# Altium schematic sheet BMS Slave.SchDoc
size OrCAD C
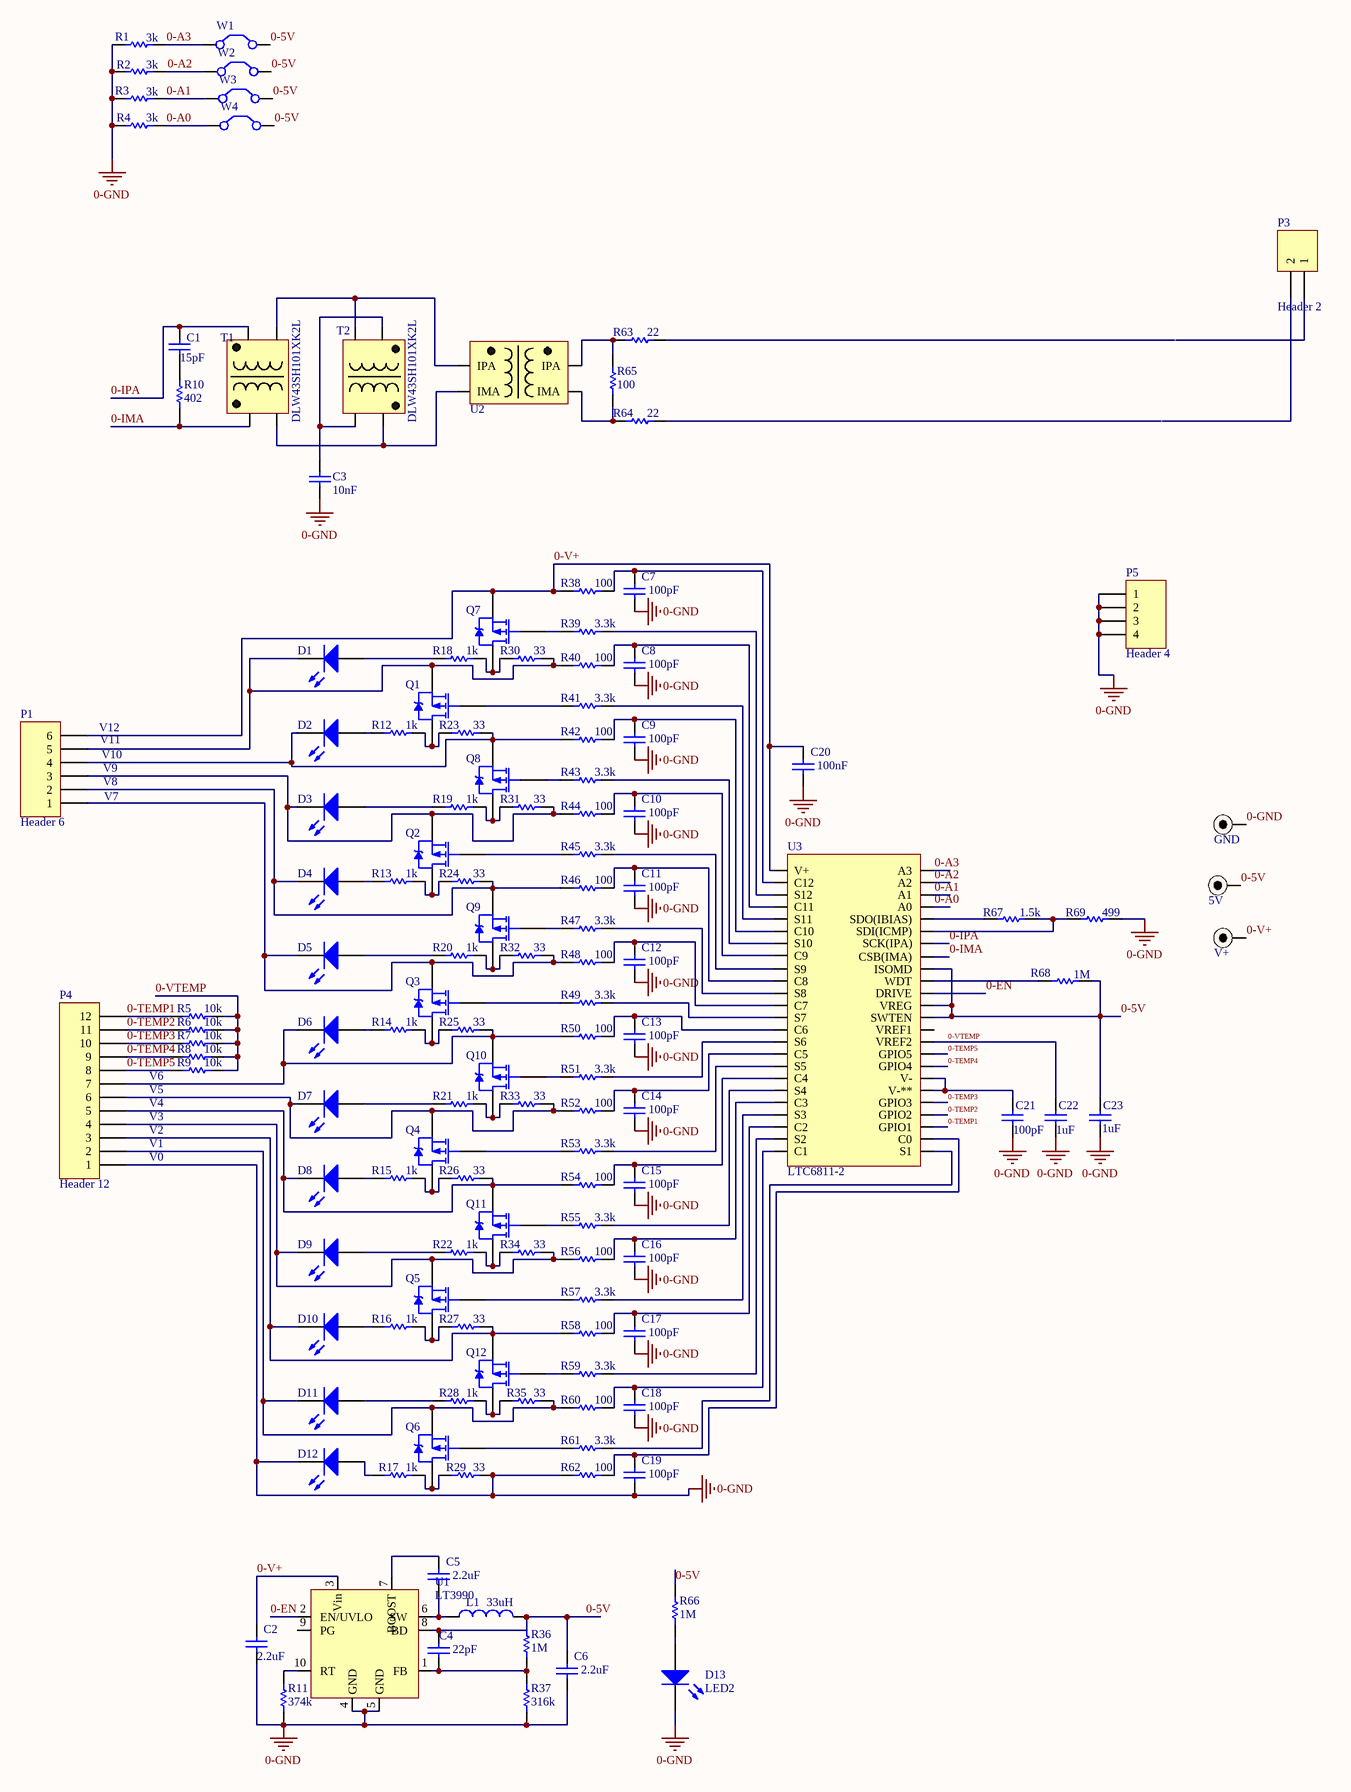
[diagram p0: BMS Slave.SchDoc]

## Parts
5V  EXPOSED SOLDER PAD  [TEST PAD]  (value not drawn)
C1  value 15pF  [6-0805_L]  (hidden comment: Cap)
C2  value 2.2uF  [6-0805_L]  (hidden comment: Cap)
C3  value 10nF  [6-0805_L]  (hidden comment: Cap)
C4  value 22pF  [6-0805_L]  (hidden comment: Cap)
C5  value 2.2uF  [6-0805_L]  (hidden comment: Cap)
C6  value 2.2uF  [6-0805_L]  (hidden comment: Cap)
C7  value 100pF  [6-0805_L]  (hidden comment: Cap)
C8  value 100pF  [6-0805_L]  (hidden comment: Cap)
C9  value 100pF  [6-0805_L]  (hidden comment: Cap)
C10  value 100pF  [6-0805_L]  (hidden comment: Cap)
C11  value 100pF  [6-0805_L]  (hidden comment: Cap)
C12  value 100pF  [6-0805_L]  (hidden comment: Cap)
C13  value 100pF  [6-0805_L]  (hidden comment: Cap)
C14  value 100pF  [6-0805_L]  (hidden comment: Cap)
C15  value 100pF  [6-0805_L]  (hidden comment: Cap)
C16  value 100pF  [6-0805_L]  (hidden comment: Cap)
C17  value 100pF  [6-0805_L]  (hidden comment: Cap)
C18  value 100pF  [6-0805_L]  (hidden comment: Cap)
C19  value 100pF  [6-0805_L]  (hidden comment: Cap)
C20  value 100nF  [6-0805_L]  (hidden comment: Cap)
C21  value 100pF  [6-0805_L]  (hidden comment: Cap)
C22  value 1uF  [6-0805_L]  (hidden comment: Cap)
C23  value 1uF  [6-0805_L]  (hidden comment: Cap)
D1  Green LED  [1608[0603]]  (value not drawn)
D2  Green LED  [1608[0603]]  (value not drawn)
D3  Green LED  [1608[0603]]  (value not drawn)
D4  Green LED  [1608[0603]]  (value not drawn)
D5  Green LED  [1608[0603]]  (value not drawn)
D6  Green LED  [1608[0603]]  (value not drawn)
D7  Green LED  [1608[0603]]  (value not drawn)
D8  Green LED  [1608[0603]]  (value not drawn)
D9  Green LED  [1608[0603]]  (value not drawn)
D10  Green LED  [1608[0603]]  (value not drawn)
D11  Green LED  [1608[0603]]  (value not drawn)
D12  Green LED  [1608[0603]]  (value not drawn)
D13  LED2  [3.2X1.6X1.1]
GND  EXPOSED SOLDER PAD  [TEST PAD]  (value not drawn)
L1  value 33uH  [0402-A]  (hidden comment: Inductor)
P1  Header 6  [HDR2X3_CEN]
P3  Header 2  [MOLEX MICROCLASP 2POS RIGHT ANGLE]
P4  Header 12  [HDR2X6]
P5  Header 4  [HDR2X2]
Q1  SI2347DS-T1-GE3  [SOT23-3N]  (value not drawn)
Q2  SI2347DS-T1-GE3  [SOT23-3N]  (value not drawn)
Q3  SI2347DS-T1-GE3  [SOT23-3N]  (value not drawn)
Q4  SI2347DS-T1-GE3  [SOT23-3N]  (value not drawn)
Q5  SI2347DS-T1-GE3  [SOT23-3N]  (value not drawn)
Q6  SI2347DS-T1-GE3  [SOT23-3N]  (value not drawn)
Q7  SI2347DS-T1-GE3  [SOT23-3N]  (value not drawn)
Q8  SI2347DS-T1-GE3  [SOT23-3N]  (value not drawn)
Q9  SI2347DS-T1-GE3  [SOT23-3N]  (value not drawn)
Q10  SI2347DS-T1-GE3  [SOT23-3N]  (value not drawn)
Q11  SI2347DS-T1-GE3  [SOT23-3N]  (value not drawn)
Q12  SI2347DS-T1-GE3  [SOT23-3N]  (value not drawn)
R1  value 3k  [6-0805_L]  (hidden comment: Res1)
R2  value 3k  [6-0805_L]  (hidden comment: Res1)
R3  value 3k  [6-0805_L]  (hidden comment: Res1)
R4  value 3k  [6-0805_L]  (hidden comment: Res1)
R5  value 10k  [6-0805_L]  (hidden comment: Res1)
R6  value 10k  [6-0805_L]  (hidden comment: Res1)
R7  value 10k  [6-0805_L]  (hidden comment: Res1)
R8  value 10k  [6-0805_L]  (hidden comment: Res1)
R9  value 10k  [6-0805_L]  (hidden comment: Res1)
R10  value 402  [6-0805_L]  (hidden comment: Res1)
R11  value 374k  [6-0805_L]  (hidden comment: Res1)
R12  value 1k  [1608[0603]]  (hidden comment: ESR03EZPJ102)
R13  value 1k  [1608[0603]]  (hidden comment: ESR03EZPJ102)
R14  value 1k  [1608[0603]]  (hidden comment: ESR03EZPJ102)
R15  value 1k  [1608[0603]]  (hidden comment: ESR03EZPJ102)
R16  value 1k  [1608[0603]]  (hidden comment: ESR03EZPJ102)
R17  value 1k  [1608[0603]]  (hidden comment: ESR03EZPJ102)
R18  value 1k  [1608[0603]]  (hidden comment: ESR03EZPJ102)
R19  value 1k  [1608[0603]]  (hidden comment: ESR03EZPJ102)
R20  value 1k  [1608[0603]]  (hidden comment: ESR03EZPJ102)
R21  value 1k  [1608[0603]]  (hidden comment: ESR03EZPJ102)
R22  value 1k  [1608[0603]]  (hidden comment: ESR03EZPJ102)
R23  value 33  [RES_4122]  (hidden comment: Res1)
R24  value 33  [RES_4122]  (hidden comment: Res1)
R25  value 33  [RES_4122]  (hidden comment: Res1)
R26  value 33  [RES_4122]  (hidden comment: Res1)
R27  value 33  [RES_4122]  (hidden comment: Res1)
R28  value 1k  [1608[0603]]  (hidden comment: ESR03EZPJ102)
R29  value 33  [RES_4122]  (hidden comment: Res1)
R30  value 33  [RES_4122]  (hidden comment: Res1)
R31  value 33  [RES_4122]  (hidden comment: Res1)
R32  value 33  [RES_4122]  (hidden comment: Res1)
R33  value 33  [RES_4122]  (hidden comment: Res1)
R34  value 33  [RES_4122]  (hidden comment: Res1)
R35  value 33  [RES_4122]  (hidden comment: Res1)
R36  value 1M  [6-0805_L]  (hidden comment: Res1)
R37  value 316k  [6-0805_L]  (hidden comment: Res1)
R38  value 100  [6-0805_L]  (hidden comment: Res1)
R39  value 3.3k  [6-0805_L]  (hidden comment: Res1)
R40  value 100  [6-0805_L]  (hidden comment: Res1)
R41  value 3.3k  [6-0805_L]  (hidden comment: Res1)
R42  value 100  [6-0805_L]  (hidden comment: Res1)
R43  value 3.3k  [6-0805_L]  (hidden comment: Res1)
R44  value 100  [6-0805_L]  (hidden comment: Res1)
R45  value 3.3k  [6-0805_L]  (hidden comment: Res1)
R46  value 100  [6-0805_L]  (hidden comment: Res1)
R47  value 3.3k  [6-0805_L]  (hidden comment: Res1)
R48  value 100  [6-0805_L]  (hidden comment: Res1)
R49  value 3.3k  [6-0805_L]  (hidden comment: Res1)
R50  value 100  [6-0805_L]  (hidden comment: Res1)
R51  value 3.3k  [6-0805_L]  (hidden comment: Res1)
R52  value 100  [6-0805_L]  (hidden comment: Res1)
R53  value 3.3k  [6-0805_L]  (hidden comment: Res1)
R54  value 100  [6-0805_L]  (hidden comment: Res1)
R55  value 3.3k  [6-0805_L]  (hidden comment: Res1)
R56  value 100  [6-0805_L]  (hidden comment: Res1)
R57  value 3.3k  [6-0805_L]  (hidden comment: Res1)
R58  value 100  [6-0805_L]  (hidden comment: Res1)
R59  value 3.3k  [6-0805_L]  (hidden comment: Res1)
R60  value 100  [6-0805_L]  (hidden comment: Res1)
R61  value 3.3k  [6-0805_L]  (hidden comment: Res1)
R62  value 100  [6-0805_L]  (hidden comment: Res1)
R63  value 22  [6-0805_L]  (hidden comment: Res1)
R64  value 22  [6-0805_L]  (hidden comment: Res1)
R65  value 100  [6-0805_L]  (hidden comment: Res1)
R66  value 1M  [6-0805_L]  (hidden comment: Res1)
R67  value 1.5k  [6-0805_L]  (hidden comment: Res1)
R68  value 1M  [6-0805_L]  (hidden comment: Res1)
R69  value 499  [6-0805_L]  (hidden comment: Res1)
T1  DLW43SH101XK2L  [DLW43SH101XK2L]
T2  DLW43SH101XK2L  [DLW43SH101XK2L]
U1  LT3990  [LT3990]
U2  PE68386  [PE68386]  (value not drawn)
U3  LTC6811-2  [SSOP50P780X200-48N]
V+  EXPOSED SOLDER PAD  [TEST PAD]  (value not drawn)
W1  Jumper  [jumper]  (value not drawn)
W2  Jumper  [jumper]  (value not drawn)
W3  Jumper  [jumper]  (value not drawn)
W4  Jumper  [jumper]  (value not drawn)

## Nets
0-GND: C2.1 C3.2 C6.1 C7.1 C8.1 C9.1 C10.1 C11.1 C12.1 C13.1 C14.1 C15.1 C16.1 C17.1 C18.1 C19.1 C20.1 C21.1 C22.2 C23.1 D12.2(K) D13.2(K) GND.1(PAD) P4.8(1) P5.1 P5.2 P5.3 P5.4 R1.1 R2.1 R3.1 R4.1 R11.1 R29.1 R37.1 R62.2 R69.2 U1.4(GND) U1.5(GND)
0-5V: 5V.1(PAD) C4.2 C6.2 C23.2 L1.2 R36.2 R66.1 R68.2 U1.8(BD) U3.36(SWTEN) U3.37(VREG) U3.40(ISOMD) W1.2(C2) W2.2(C2) W3.2(C2) W4.2(C2)
0-A0: R4.2 U3.45(A0) W4.1(C1)
0-A1: R3.2 U3.46(A1) W3.1(C1)
0-A2: R2.2 U3.47(A2) W2.1(C1)
0-A3: R1.2 U3.48(A3) W1.1(C1)
0-EN: U1.2(EN/UVLO) U3.38(DRIVE)
0-IMA: R10.1 T1.1 U3.41(CSB(IMA))
0-IPA: C1.2 T1.4 U3.42(SCK(IPA))
0-TEMP1: P4.10(12) R5.2 U3.27(GPIO1)
0-TEMP2: P4.12(11) R6.2 U3.28(GPIO2)
0-TEMP3: P4.11(10) R7.2 U3.29(GPIO3)
0-TEMP4: P4.9 R8.2 U3.32(GPIO4)
0-TEMP5: P4.7(8) R9.2 U3.33(GPIO5)
0-V+: C2.2 C20.2 P1.6 Q7.3(S) R38.2 U1.3(Vin) U3.1(V+) V+.1(PAD)
0-VTEMP: C22.1 R5.1 R6.1 R7.1 R8.1 R9.1 U3.34(VREF2)
NetC1_1: C1.1 R10.2
NetC3_1: C3.1 T2.1 T2.3
NetC4_1: C4.1 R36.1 R37.2 U1.1(FB)
NetC5_1: C5.1 L1.1 U1.6(SW)
NetC5_2: C5.2 U1.7(BOOST)
NetC7_2: C7.2 R38.1 U3.2(C12)
NetC8_2: C8.2 R40.1 U3.4(C11)
NetC9_2: C9.2 R42.1 U3.6(C10)
NetC10_2: C10.2 R44.1 U3.8(C9)
NetC11_2: C11.2 R46.1 U3.10(C8)
NetC12_2: C12.2 R48.1 U3.12(C7)
NetC13_2: C13.2 R50.1 U3.14(C6)
NetC14_2: C14.2 R52.1 U3.16(C5)
NetC15_2: C15.2 R54.1 U3.18(C4)
NetC16_2: C16.2 R56.1 U3.20(C3)
NetC17_2: C17.2 R58.1 U3.22(C2)
NetC18_2: C18.2 R60.1 U3.24(C1)
NetC19_2: C19.2 R62.1 U3.26(C0)
NetC21_2: C21.2 U3.30(V-**) U3.31(V-)
NetD1_1: D1.1(A) R18.1
NetD1_2: D1.2(K) P1.3(5) Q1.3(S) R30.1 R40.2
NetD2_1: D2.1(A) R12.2
NetD2_2: D2.2(K) P1.2(4) Q8.3(S) R23.1 R42.2
NetD3_1: D3.1(A) R19.1
NetD3_2: D3.2(K) P1.1(3) Q2.3(S) R31.1 R44.2
NetD4_1: D4.1(A) R13.1
NetD4_2: D4.2(K) P1.4(2) Q9.3(S) R24.1 R46.2
NetD5_1: D5.1(A) R20.1
NetD5_2: D5.2(K) P1.5(1) Q3.3(S) R32.1 R48.2
NetD6_1: D6.1(A) R14.1
NetD6_2: D6.2(K) P4.5(7) Q10.3(S) R25.1 R50.2
NetD7_1: D7.1(A) R21.1
NetD7_2: D7.2(K) P4.3(6) Q4.3(S) R33.1 R52.2
NetD8_1: D8.1(A) R15.1
NetD8_2: D8.2(K) P4.1(5) Q11.3(S) R26.1 R54.2
NetD9_1: D9.1(A) R22.1
NetD9_2: D9.2(K) P4.2(4) Q5.3(S) R34.1 R56.2
NetD10_1: D10.1(A) R16.1
NetD10_2: D10.2(K) P4.4(3) Q12.3(S) R27.1 R58.2
NetD11_1: D11.1(A) R28.1
NetD11_2: D11.2(K) P4.6(2) Q6.3(S) R35.1 R60.2
NetD12_1: D12.1(A) R17.1
NetD13_1: D13.1(A) R66.2
NetQ1_1: Q1.1(G) R41.2
NetQ1_2: Q1.2(D) R12.1 R23.2
NetQ2_1: Q2.1(G) R45.2
NetQ2_2: Q2.2(D) R13.2 R24.2
NetQ3_1: Q3.1(G) R49.2
NetQ3_2: Q3.2(D) R14.2 R25.2
NetQ4_1: Q4.1(G) R53.2
NetQ4_2: Q4.2(D) R15.2 R26.2
NetQ5_1: Q5.1(G) R57.2
NetQ5_2: Q5.2(D) R16.2 R27.2
NetQ6_1: Q6.1(G) R61.2
NetQ6_2: Q6.2(D) R17.2 R29.2
NetQ7_1: Q7.1(G) R39.2
NetQ7_2: Q7.2(D) R18.2 R30.2
NetQ8_1: Q8.1(G) R43.2
NetQ8_2: Q8.2(D) R19.2 R31.2
NetQ9_1: Q9.1(G) R47.2
NetQ9_2: Q9.2(D) R20.2 R32.2
NetQ10_1: Q10.1(G) R51.2
NetQ10_2: Q10.2(D) R21.2 R33.2
NetQ11_1: Q11.1(G) R55.2
NetQ11_2: Q11.2(D) R22.2 R34.2
NetQ12_1: Q12.1(G) R59.2
NetQ12_2: Q12.2(D) R28.2 R35.2
NetR11_2: R11.2 U1.10(RT)
NetR39_1: R39.1 U3.3(S12)
NetR41_1: R41.1 U3.5(S11)
NetR43_1: R43.1 U3.7(S10)
NetR45_1: R45.1 U3.9(S9)
NetR47_1: R47.1 U3.11(S8)
NetR49_1: R49.1 U3.13(S7)
NetR51_1: R51.1 U3.15(S6)
NetR53_1: R53.1 U3.17(S5)
NetR55_1: R55.1 U3.19(S4)
NetR57_1: R57.1 U3.21(S3)
NetR59_1: R59.1 U3.23(S2)
NetR61_1: R61.1 U3.25(S1)
NetR63_2: R63.2 R65.2 U2.4(IPA)
NetR64_2: R64.2 R65.1 U2.3(IMA)
NetR67_1: R67.1 U3.44(SDO(IBIAS))
NetR67_2: R67.2 R69.1 U3.43(SDI(ICMP))
NetR68_1: R68.1 U3.39(WDT)
NetT1_2: T1.2 T2.4 U2.2(IMA)
NetT1_3: T1.3 T2.2 U2.1(IPA)

Not connected (* = marked no-connect by the designer): P3 1 2; R63 1; R64 1; U1 9(PG); U3 35(VREF1)

## Notes on the sheet
- (near P1) V12
- (near P1) V11
- (near P1) V10
- (near P1) V9
- (near P1) V8
- (near P1) V7
- V4
- V5
- V6
- (near P4) V0
- V1
- V2
- V3
- Title
- Size:
- Date:
- File:
- Orcad C
- Number:
- Time:
- Revision:
- Sheet
- of

## Library data of the parts
5V GND V+ = EXPOSED SOLDER PAD: testing point
C1-C23 = Cap: Capacitor; Published: 8-Jun-2000; LatestRevisionDate: 17-Jul-2002; LatestRevisionNote: Re-released for DXP Platform.; PackageReference: RAD-0.3; Publisher: Altium Limited; PackageDescription: Radial Cap, Thru-Hole; 2 Leads; 0.3 in Pin Spacing
D1-D12 = LED2: LG L29K-G2J1-24-Z; Published: 8-Jun-2000; LatestRevisionDate: 17-Jul-2002; LatestRevisionNote: Re-released for DXP Platform.; PackageVersion: Feb-2002; PackageReference: 3.2X1.6X1.1; Publisher: Altium Limited; PackageDescription: SM LED; 2 Flat Leads; ComponentLink1Description: LG L29K-G2J1-24-Z; ComponentLink1URL: https://www.digikey.ca/product-detail/en/osram-opto-semiconductors-inc/LG-L29K-G2J1-24-Z/475-2709-1-ND/1938876
D13 = LED2: Typical RED, GREEN, YELLOW, AMBER GaAs LED; Published: 8-Jun-2000; LatestRevisionDate: 17-Jul-2002; LatestRevisionNote: Re-released for DXP Platform.; PackageVersion: Feb-2002; PackageReference: 3.2X1.6X1.1; Publisher: Altium Limited; PackageDescription: SM LED; 2 Flat Leads
L1 = Inductor: Code_IEC: 1005; Published: 8-Jun-2000; LatestRevisionDate: 29-May-2009; LatestRevisionNote: IPC-7351 Footprint Added.; PackageReference: 0402-A; Publisher: Altium Limited; PackageDescription: Chip Inductor; Code_JEITA: 0402
P1 = Header 6: Header, 6-Pin; LatestRevisionDate: 17-Jul-2002; LatestRevisionNote: Re-released for DXP Platform.; Publisher: Altium Limited
P3 = Header 2: Header, 2-Pin; LatestRevisionDate: 17-Jul-2002; LatestRevisionNote: Re-released for DXP Platform.; Publisher: Altium Limited
P4 = Header 12: Header, 12-Pin; LatestRevisionDate: 17-Jul-2002; LatestRevisionNote: Re-released for DXP Platform.; Publisher: Altium Limited
P5 = Header 4: Header, 4-Pin; LatestRevisionDate: 17-Jul-2002; LatestRevisionNote: Re-released for DXP Platform.; Publisher: Altium Limited
Q1-Q12 = PMOS-2: MOSFET P-CH 30V 5A SOT-23; Note: Pin 4 not drawn and electrically connected to Pin 2.; Published: 8-Jun-2000; LatestRevisionDate: 17-Jul-2002; LatestRevisionNote: Re-released for DXP Platform.; DatasheetVersion: PD-9.390D; PackageVersion: Feb-1997; PackageReference: TO-220AB; Publisher: Altium Limited; PackageDescription: TO, Thru-Hole, Vertical, Heatsink Mounted; 3 In-Line Leads; Pitch 2.54 mm
  Q1-Q6 Q8-Q12: ComponentLink1Description: Manufacturer Link; ComponentLink1URL: http://www.irf.com/
  Q7: ComponentLink1Description: SI2347DS-T1-GE3; ComponentLink1URL: https://www.digikey.ca/product-detail/en/vishay-siliconix/SI2347DS-T1-GE3/SI2347DS-T1-GE3CT-ND/5805425
R1-R11 R23-R27 R29-R69 = Res1: Resistor; Published: 8-Jun-2000; LatestRevisionDate: 17-Jul-2002; LatestRevisionNote: Re-released for DXP Platform.; PackageReference: AXIAL-0.3; Publisher: Altium Limited; PackageDescription: Axial Device, Thru-Hole; 2 Leads; 0.3 in Pin Spacing
R12-R22 R28 = Res1: Current Limiting Resistor for Green LED; Published: 8-Jun-2000; LatestRevisionDate: 17-Jul-2002; LatestRevisionNote: Re-released for DXP Platform.; PackageReference: AXIAL-0.3; Publisher: Altium Limited; PackageDescription: Axial Device, Thru-Hole; 2 Leads; 0.3 in Pin Spacing
  R18: ComponentLink1Description: ESR03EZPJ102; ComponentLink1URL: https://www.digikey.ca/product-detail/en/rohm-semiconductor/ESR03EZPJ102/RHM1.0KDCT-ND/1762924
T1 T2 = DLW43SH101XK2L: 100uH CMC
U1 = LT3990: LT3990 62V, 350mA Step-Down Regulator; Mfr 1: Linear Technologies; Mfr 1 PN: LT3990
U2 = PE68386: 1:1 isolation transformer
U3 = LTC6811-2: 12-cell battery management chip
W1-W4 = Jumper: Jumper Wire; Published: 24-Mar-1999; LatestRevisionDate: 17-Jul-2002; LatestRevisionNote: Re-released for DXP Platform.; PackageReference: RAD-0.2; Publisher: Altium Limited; PackageDescription: Radial Cap, Thru-Hole; 2 Leads; 0.2 in Pin Spacing